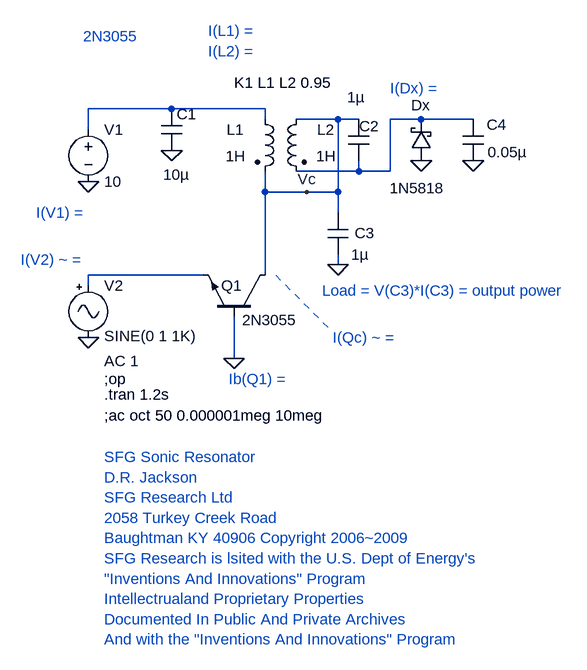
[diagram p0: schematic 2N3055_unloaded.asc]
2N3055_unloaded.asc, the LTspice schematic file:
Version 4
SHEET 1 1092 708
WIRE 128 -96 0 -96
WIRE 272 -96 128 -96
WIRE 272 -80 272 -96
WIRE 384 -80 320 -80
WIRE 416 -80 384 -80
WIRE 512 -80 464 -80
WIRE 592 -80 512 -80
WIRE 0 -64 0 -96
WIRE 416 0 416 -16
WIRE 416 0 320 0
WIRE 464 0 464 -80
WIRE 464 0 416 0
WIRE 272 32 272 0
WIRE 336 32 272 32
WIRE 384 32 384 -80
WIRE 384 32 336 32
WIRE 384 64 384 32
WIRE 384 144 384 128
WIRE 176 160 0 160
WIRE 272 160 272 32
WIRE 0 176 0 160
WIRE 224 288 224 224
FLAG 224 288 0
FLAG 0 16 0
FLAG 0 256 0
FLAG 512 -16 0
FLAG 128 -32 0
FLAG 336 32 Vc
FLAG 592 -16 0
FLAG 384 144 0
SYMBOL npn 272 224 M270
WINDOW 0 48 68 VLeft 0
WINDOW 3 -5 35 VLeft 0
SYMATTR InstName Q1
SYMATTR Value 2N3055
SYMBOL voltage 0 -80 R0
WINDOW 123 0 0 Left 0
WINDOW 39 0 0 Left 0
SYMATTR InstName V1
SYMATTR Value 10
SYMBOL Misc\\signal 0 160 R0
WINDOW 123 24 132 Left 0
WINDOW 39 0 0 Left 0
WINDOW 3 24 94 Left 0
SYMATTR Value2 AC 1
SYMATTR InstName V2
SYMBOL ind2 256 -96 R0
WINDOW 0 -43 32 Left 0
WINDOW 3 -45 73 Left 0
SYMATTR InstName L1
SYMATTR Value 1H
SYMATTR Type ind
SYMBOL ind2 336 -96 M0
WINDOW 0 -43 32 Left 0
WINDOW 3 -45 73 Left 0
SYMATTR InstName L2
SYMATTR Value 1H
SYMATTR Type ind
SYMBOL schottky 528 -16 R180
WINDOW 0 2 86 Left 0
WINDOW 3 -20 -42 Left 0
SYMATTR InstName Dx
SYMATTR Value 1N5818
SYMATTR Description Diode
SYMATTR Type diode
SYMBOL cap 112 -96 R0
WINDOW 3 3 101 Left 0
SYMATTR Value 10µ
SYMATTR InstName C1
SYMBOL cap 400 -80 R0
WINDOW 0 17 11 Left 0
WINDOW 3 -2 -34 Left 0
SYMATTR InstName C2
SYMATTR Value 1µ
SYMBOL cap 576 -80 R0
WINDOW 0 37 8 Left 0
WINDOW 3 38 51 Left 0
SYMATTR InstName C4
SYMATTR Value 0.05µ
SYMBOL cap 368 64 R0
WINDOW 0 42 31 Left 0
WINDOW 3 36 64 Left 0
SYMATTR InstName C3
SYMATTR Value 1µ
TEXT 24 320 Left 0 !;op
TEXT 24 344 Left 0 !.tran 1.2s
TEXT 24 376 Left 0 !;ac oct 50 0.000001meg 10meg
TEXT 224 -136 Left 0 !K1 L1 L2 0.95
TEXT 24 440 Left 0 ;SFG Sonic Resonator\nD.R. Jackson\nSFG Research Ltd\n2058 Turkey Creek Road\nBaughtman KY 40906 Copyright 2006~2009\nSFG Research is lsited with the U.S. Dept of Energy's\n"Inventions And Innovations" Program\nIntellectrualand Proprietary Properties\nDocumented In Public And Private Archives\nAnd with the "Inventions And Innovations" Program
TEXT 360 184 Left 0 ;Load = V(C3)*I(C3) = output power
TEXT -80 64 Left 0 ;I(V1) =
TEXT 464 -128 Left 0 ;I(Dx) =
TEXT -104 136 Left 0 ;I(V2) ~ =
TEXT 376 256 Left 0 ;I(Qc) ~ =
TEXT 184 -216 Left 0 ;I(L1) = \nI(L2) =
TEXT -8 -208 Left 0 ;2N3055
TEXT 216 320 Left 0 ;Ib(Q1) =
LINE Normal 288 160 368 240 2
LINE Normal 272 160 272 160
LINE Normal 272 160 272 160
LINE Normal 272 160 272 160
LINE Normal 272 160 272 160
LINE Normal 272 160 272 160

The netlist it stands for:
* 2N3055_unloaded.asc
Q1 Vc 0 N003 0 2N3055
V1 N001 0 10
V2 N003 0 SINE(0 1 1K) AC 1
L1 N001 Vc 1H
L2 Vc N002 1H
Dx 0 N002 1N5818
C1 N001 0 10µ
C2 Vc N002 1µ
C4 N002 0 0.05µ
C3 Vc 0 1µ
.model D D
.lib standard.dio
.model NPN NPN
.model PNP PNP
.lib standard.bjt
;op
.tran 1.2s
;ac oct 50 0.000001meg 10meg
K1 L1 L2 0.95
* SFG Sonic Resonator
* D.R. Jackson
* SFG Research Ltd
* 2058 Turkey Creek Road
* Baughtman KY 40906 Copyright 2006~2009
* SFG Research is lsited with the U.S. Dept of Energy's
* "Inventions And Innovations" Program
* Intellectrualand Proprietary Properties
* Documented In Public And Private Archives
* And with the "Inventions And Innovations" Program
* Load = V(C3)*I(C3) = output power
* I(V1) =
* I(Dx) =
* I(V2) ~ =
* I(Qc) ~ =
* I(L1) =
* I(L2) =
* 2N3055
* Ib(Q1) =
.backanno
.end